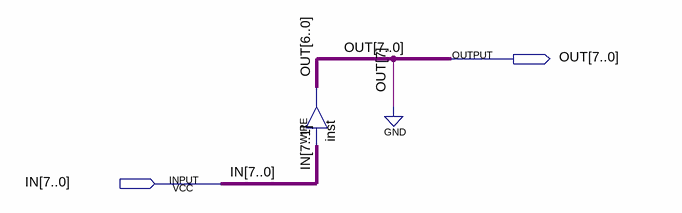
[diagram p0: schematic sheet]
// Quartus schematic SHIFT_RIGHT_1.bdf as structural Verilog: 1 symbols, 2 pins
module SHIFT_RIGHT_1 (
  input  [7:0] IN,
  output [7:0] OUT
);

  assign OUT[6:0] = IN[7:1];  // WIRE inst

  assign OUT[7] = 1'b0;
endmodule
